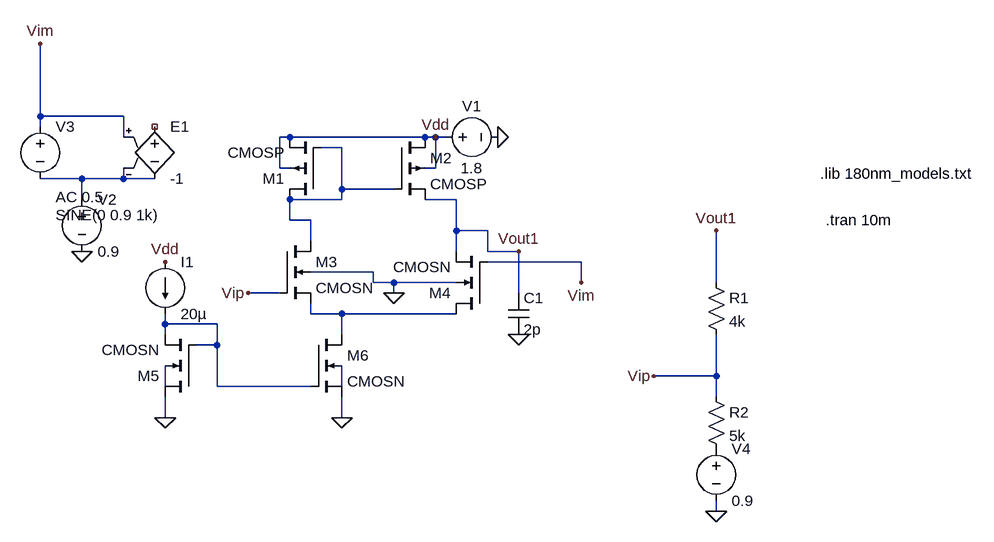
[diagram p0: schematic Schmitt_Trigger(Differential).asc]
Schmitt_Trigger(Differential).asc, the LTspice schematic file:
Version 4
SHEET 1 1272 680
WIRE -192 0 -192 -112
WIRE -64 0 -192 0
WIRE -192 16 -192 0
WIRE -64 32 -64 0
WIRE 192 32 176 32
WIRE 400 32 192 32
WIRE 416 32 400 32
WIRE 432 32 416 32
WIRE 272 48 240 48
WIRE 176 80 176 32
WIRE 192 80 176 80
WIRE 416 80 416 32
WIRE 416 80 400 80
WIRE -128 96 -192 96
WIRE -64 96 -64 80
WIRE -64 96 -128 96
WIRE -16 96 -64 96
WIRE 272 112 272 48
WIRE 352 112 272 112
WIRE -128 128 -128 96
WIRE 272 128 272 112
WIRE 272 128 192 128
WIRE 448 128 400 128
WIRE 192 160 192 128
WIRE 224 160 192 160
WIRE 448 176 448 128
WIRE 496 176 448 176
WIRE 224 192 224 160
WIRE 448 208 448 176
WIRE 496 208 496 176
WIRE 544 208 496 208
WIRE 640 224 496 224
WIRE 320 240 224 240
WIRE 320 256 320 240
WIRE 352 256 320 256
WIRE 448 256 352 256
WIRE 640 256 640 224
WIRE 848 256 848 176
WIRE 176 272 128 272
WIRE 352 272 352 256
WIRE 544 272 544 208
WIRE 224 304 224 288
WIRE 272 304 224 304
WIRE 448 304 272 304
WIRE 0 320 0 304
WIRE 80 320 0 320
WIRE 0 336 0 320
WIRE 272 336 272 304
WIRE 80 352 80 320
WIRE 80 352 48 352
WIRE 848 400 848 336
WIRE 848 400 752 400
WIRE 0 416 0 384
WIRE 80 416 80 352
WIRE 224 416 80 416
WIRE 272 416 272 384
WIRE 848 432 848 400
WIRE 0 464 0 432
WIRE 272 464 272 432
WIRE 848 608 848 592
FLAG 512 32 0
FLAG 352 272 0
FLAG 0 464 0
FLAG 272 464 0
FLAG 416 32 Vdd
FLAG 0 224 Vdd
FLAG 128 272 Vip
FLAG 640 256 Vim
FLAG -128 208 0
FLAG -192 -112 Vim
FLAG 544 208 Vout1
FLAG 544 336 0
FLAG 848 608 0
FLAG 848 176 Vout1
FLAG 752 400 Vip
SYMBOL pmos4 240 128 R180
SYMATTR InstName M1
SYMATTR Value CMOSP
SYMATTR Value2 l=0.6u w=60u
SYMBOL pmos4 352 32 R0
SYMATTR InstName M2
SYMATTR Value CMOSP
SYMATTR Value2 l=0.6u w=60u
SYMBOL nmos4 176 192 R0
SYMATTR InstName M3
SYMATTR Value CMOSN
SYMATTR Value2 l=5u w=60u
SYMBOL nmos4 496 304 R180
SYMATTR InstName M4
SYMATTR Value CMOSN
SYMATTR Value2 l=5u w=60u
SYMBOL voltage 416 32 R270
WINDOW 0 32 56 VTop 2
WINDOW 3 -32 56 VBottom 2
WINDOW 123 0 0 Left 0
WINDOW 39 0 0 Left 0
SYMATTR InstName V1
SYMATTR Value 1.8
SYMBOL nmos4 48 432 R180
SYMATTR InstName M5
SYMATTR Value CMOSN
SYMATTR Value2 l=5u w=50u
SYMBOL nmos4 224 336 R0
SYMATTR InstName M6
SYMATTR Value CMOSN
SYMATTR Value2 l=5u w=50u m=10
SYMBOL current 0 224 R0
WINDOW 123 0 0 Left 0
WINDOW 39 0 0 Left 0
SYMATTR InstName I1
SYMATTR Value 20µ
SYMBOL voltage -128 112 R0
WINDOW 123 0 0 Left 0
WINDOW 39 0 0 Left 0
SYMATTR InstName V2
SYMATTR Value 0.9
SYMBOL e -16 0 R0
SYMATTR InstName E1
SYMATTR Value -1
SYMBOL cap 528 272 R0
SYMATTR InstName C1
SYMATTR Value 2p
SYMBOL voltage -192 0 R0
WINDOW 123 24 124 Left 2
WINDOW 39 0 0 Left 0
WINDOW 3 24 152 Left 2
SYMATTR Value2 AC 0.5
SYMATTR Value SINE(0 0.9 1k)
SYMATTR InstName V3
SYMBOL res 832 240 R0
SYMATTR InstName R1
SYMATTR Value 4k
SYMBOL res 832 416 R0
SYMATTR InstName R2
SYMATTR Value 5k
SYMBOL voltage 848 496 R0
WINDOW 123 0 0 Left 0
WINDOW 39 0 0 Left 0
SYMATTR InstName V4
SYMATTR Value 0.9
TEXT 1008 88 Left 2 !.lib 180nm_models.txt
TEXT 1016 160 Left 2 !.tran 10m

The netlist it stands for:
* Schmitt_Trigger(Differential).asc
M1 N001 N001 Vdd Vdd CMOSP l=0.6u w=60u
M2 Vdd N001 Vout1 Vdd CMOSP l=0.6u w=60u
M3 N001 Vip N003 0 CMOSN l=5u w=60u
M4 N003 Vim Vout1 0 CMOSN l=5u w=60u
V1 Vdd 0 1.8
M5 0 N004 N004 N005 CMOSN l=5u w=50u
M6 N003 N004 0 N006 CMOSN l=5u w=50u m=10
I1 Vdd N004 20µ
V2 N002 0 0.9
E1 NC_01 N002 Vim N002 -1
C1 Vout1 0 2p
V3 Vim N002 SINE(0 0.9 1k) AC 0.5
R1 Vout1 Vip 4k
R2 Vip P001 5k
V4 P001 0 0.9
.model NMOS NMOS
.model PMOS PMOS
.lib standard.mos
.lib 180nm_models.txt
.tran 10m
.backanno
.end